# EAGLE schematic microfono_v1_rev0 (EAGLE 6.4)
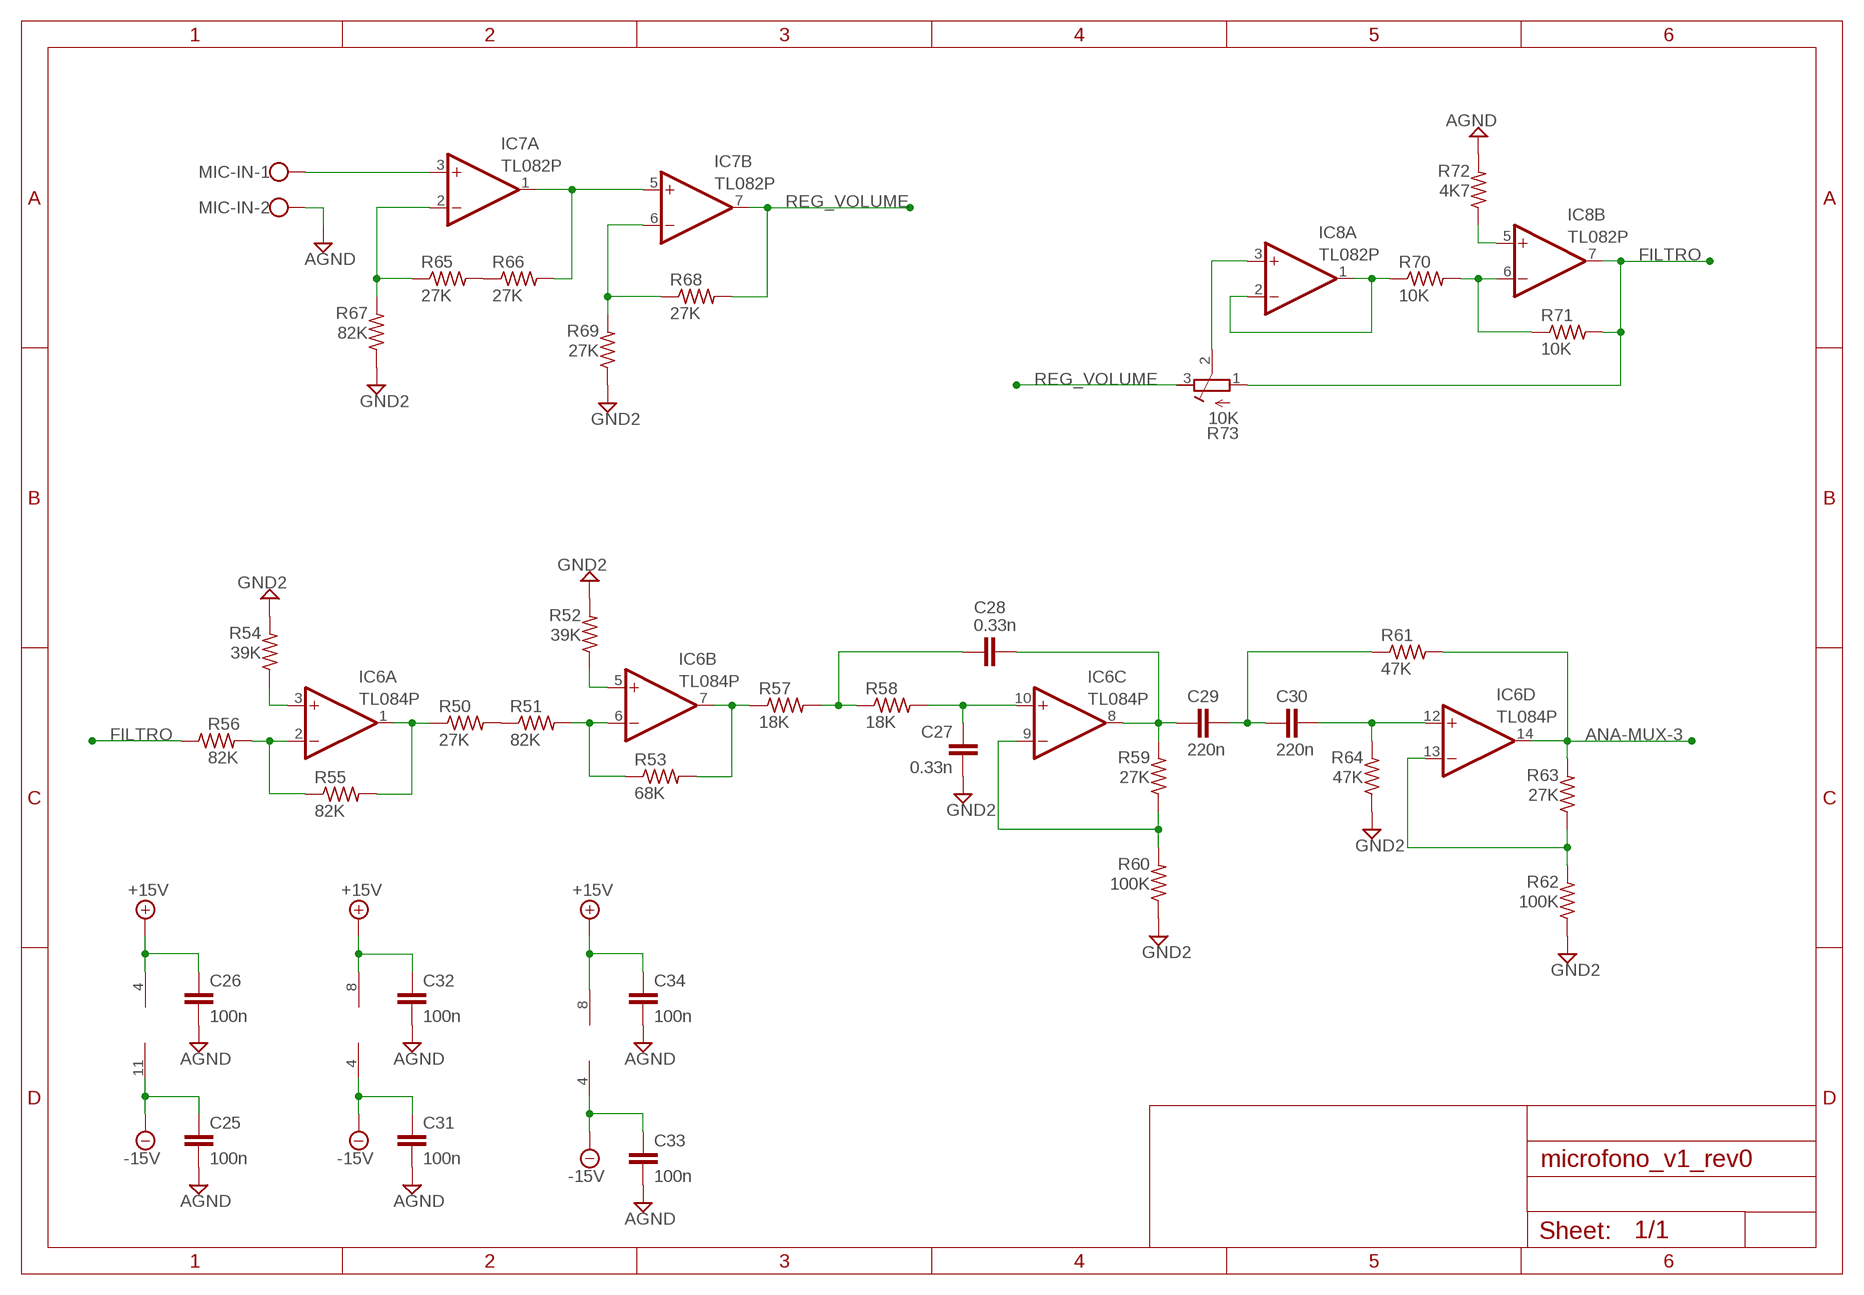
[diagram p0: schematic, sheet 1]

## Parts
C25  100n  C-EU025-025X050  [C025-025X050]
C26  100n  C-EU025-025X050  [C025-025X050]
C27  0.33n  C-EU025-025X050  [C025-025X050]
C28  0.33n  C-EU025-025X050  [C025-025X050]
C29  220n  C-EU025-025X050  [C025-025X050]
C30  220n  C-EU025-025X050  [C025-025X050]
C31  100n  C-EU025-025X050  [C025-025X050]
C32  100n  C-EU025-025X050  [C025-025X050]
C33  100n  C-EU025-025X050  [C025-025X050]
C34  100n  C-EU025-025X050  [C025-025X050]
IC6  TL084P  [DIL14]
IC7  TL082P  [DIL08]
IC8  TL082P  [DIL08]
MIC-IN  W237-102  [W237-102]
R50  27K  R-US_0204/7  [0204/7]
R51  82K  R-US_0204/7  [0204/7]
R52  39K  R-US_0204/7  [0204/7]
R53  68K  R-US_0204/7  [0204/7]
R54  39K  R-US_0204/7  [0204/7]
R55  82K  R-US_0204/7  [0204/7]
R56  82K  R-US_0204/7  [0204/7]
R57  18K  R-US_0204/7  [0204/7]
R58  18K  R-US_0204/7  [0204/7]
R59  27K  R-US_0204/7  [0204/7]
R60  100K  R-US_0204/7  [0204/7]
R61  47K  R-US_0204/7  [0204/7]
R62  100K  R-US_0204/7  [0204/7]
R63  27K  R-US_0204/7  [0204/7]
R64  47K  R-US_0204/7  [0204/7]
R65  27K  R-US_0204/7  [0204/7]
R66  27K  R-US_0204/7  [0204/7]
R67  82K  R-US_0204/7  [0204/7]
R68  27K  R-US_0204/7  [0204/7]
R69  27K  R-US_0204/7  [0204/7]
R70  10K  R-US_0204/7  [0204/7]
R71  10K  R-US_0204/7  [0204/7]
R72  4K7  R-US_0204/7  [0204/7]
R73  10K  R-TRIMM64W  [RTRIM64W]

## Nets
+15V: C26.1 C32.1 C34.1 IC6.4(P:V+) IC7.8(P:V+) IC8.8(P:V+)
-15V: C25.1 C31.1 C33.1 IC6.11(P:V-) IC7.4(P:V-) IC8.4(P:V-)
AGND: C25.2 C26.2 C31.2 C32.2 C33.2 C34.2 MIC-IN.2 R72.2
ANA-MUX-3: IC6.14(D:OUT) R61.2 R63.2
FILTRO: IC8.7(B:OUT) R56.1 R71.2 R73.1(A)
GND2: C27.2 R52.2 R54.2 R60.1 R62.1 R64.1 R67.1 R69.1
N$54: R50.2 R51.1
N$55: IC6.2(A:-IN) R55.1 R56.2
N$56: IC6.1(A:OUT) R50.1 R55.2
N$57: IC6.3(A:+IN) R54.1
N$58: IC6.6(B:-IN) R51.2 R53.1
N$59: IC6.5(B:+IN) R52.1
N$60: C27.1 IC6.10(C:+IN) R58.2
N$61: C28.1 R57.2 R58.1
N$62: C28.2 C29.1 IC6.8(C:OUT) R59.2
N$63: IC6.9(C:-IN) R59.1 R60.2
N$64: C30.2 IC6.12(D:+IN) R64.2
N$65: IC6.7(B:OUT) R53.2 R57.1
N$66: IC6.13(D:-IN) R62.2 R63.1
N$67: R65.2 R66.1
N$68: C29.2 C30.1 R61.1
N$69: IC7.2(A:-IN) R65.1 R67.2
N$70: IC7.3(A:+IN) MIC-IN.1
N$72: IC7.6(B:-IN) R68.1 R69.2
N$73: IC8.3(A:+IN) R73.2(S)
N$74: IC7.1(A:OUT) IC7.5(B:+IN) R66.2
N$76: IC8.6(B:-IN) R70.2 R71.1
N$77: IC8.5(B:+IN) R72.1
N$78: IC8.1(A:OUT) IC8.2(A:-IN) R70.1
REG_VOLUME: IC7.7(B:OUT) R68.2 R73.3(E)

## Library data of the parts
C25-C34 = rcl:C-EU: CAPACITOR, European symbol
IC6 = linear:TL084: OP AMP
IC7 IC8 = linear:TL082: OP AMP
MIC-IN = con-wago-500:W237-102: WAGO SCREW CLAMP; MPN: 237-102; OC_FARNELL: unknown; OC_NEWARK: 70K9898
R50-R72 = rcl:R-US_: RESISTOR, American symbol
R73 = rcl:R-TRIMM: Trimm resistor